# Altium schematic sheet Block Diagram.SchDoc
size A3; Revision: 00; SheetNumber: 2; SheetTotal: 5; Page Size: A3; Prepared By: Rumeysa Şahin; Changed Date: 15.11.2022
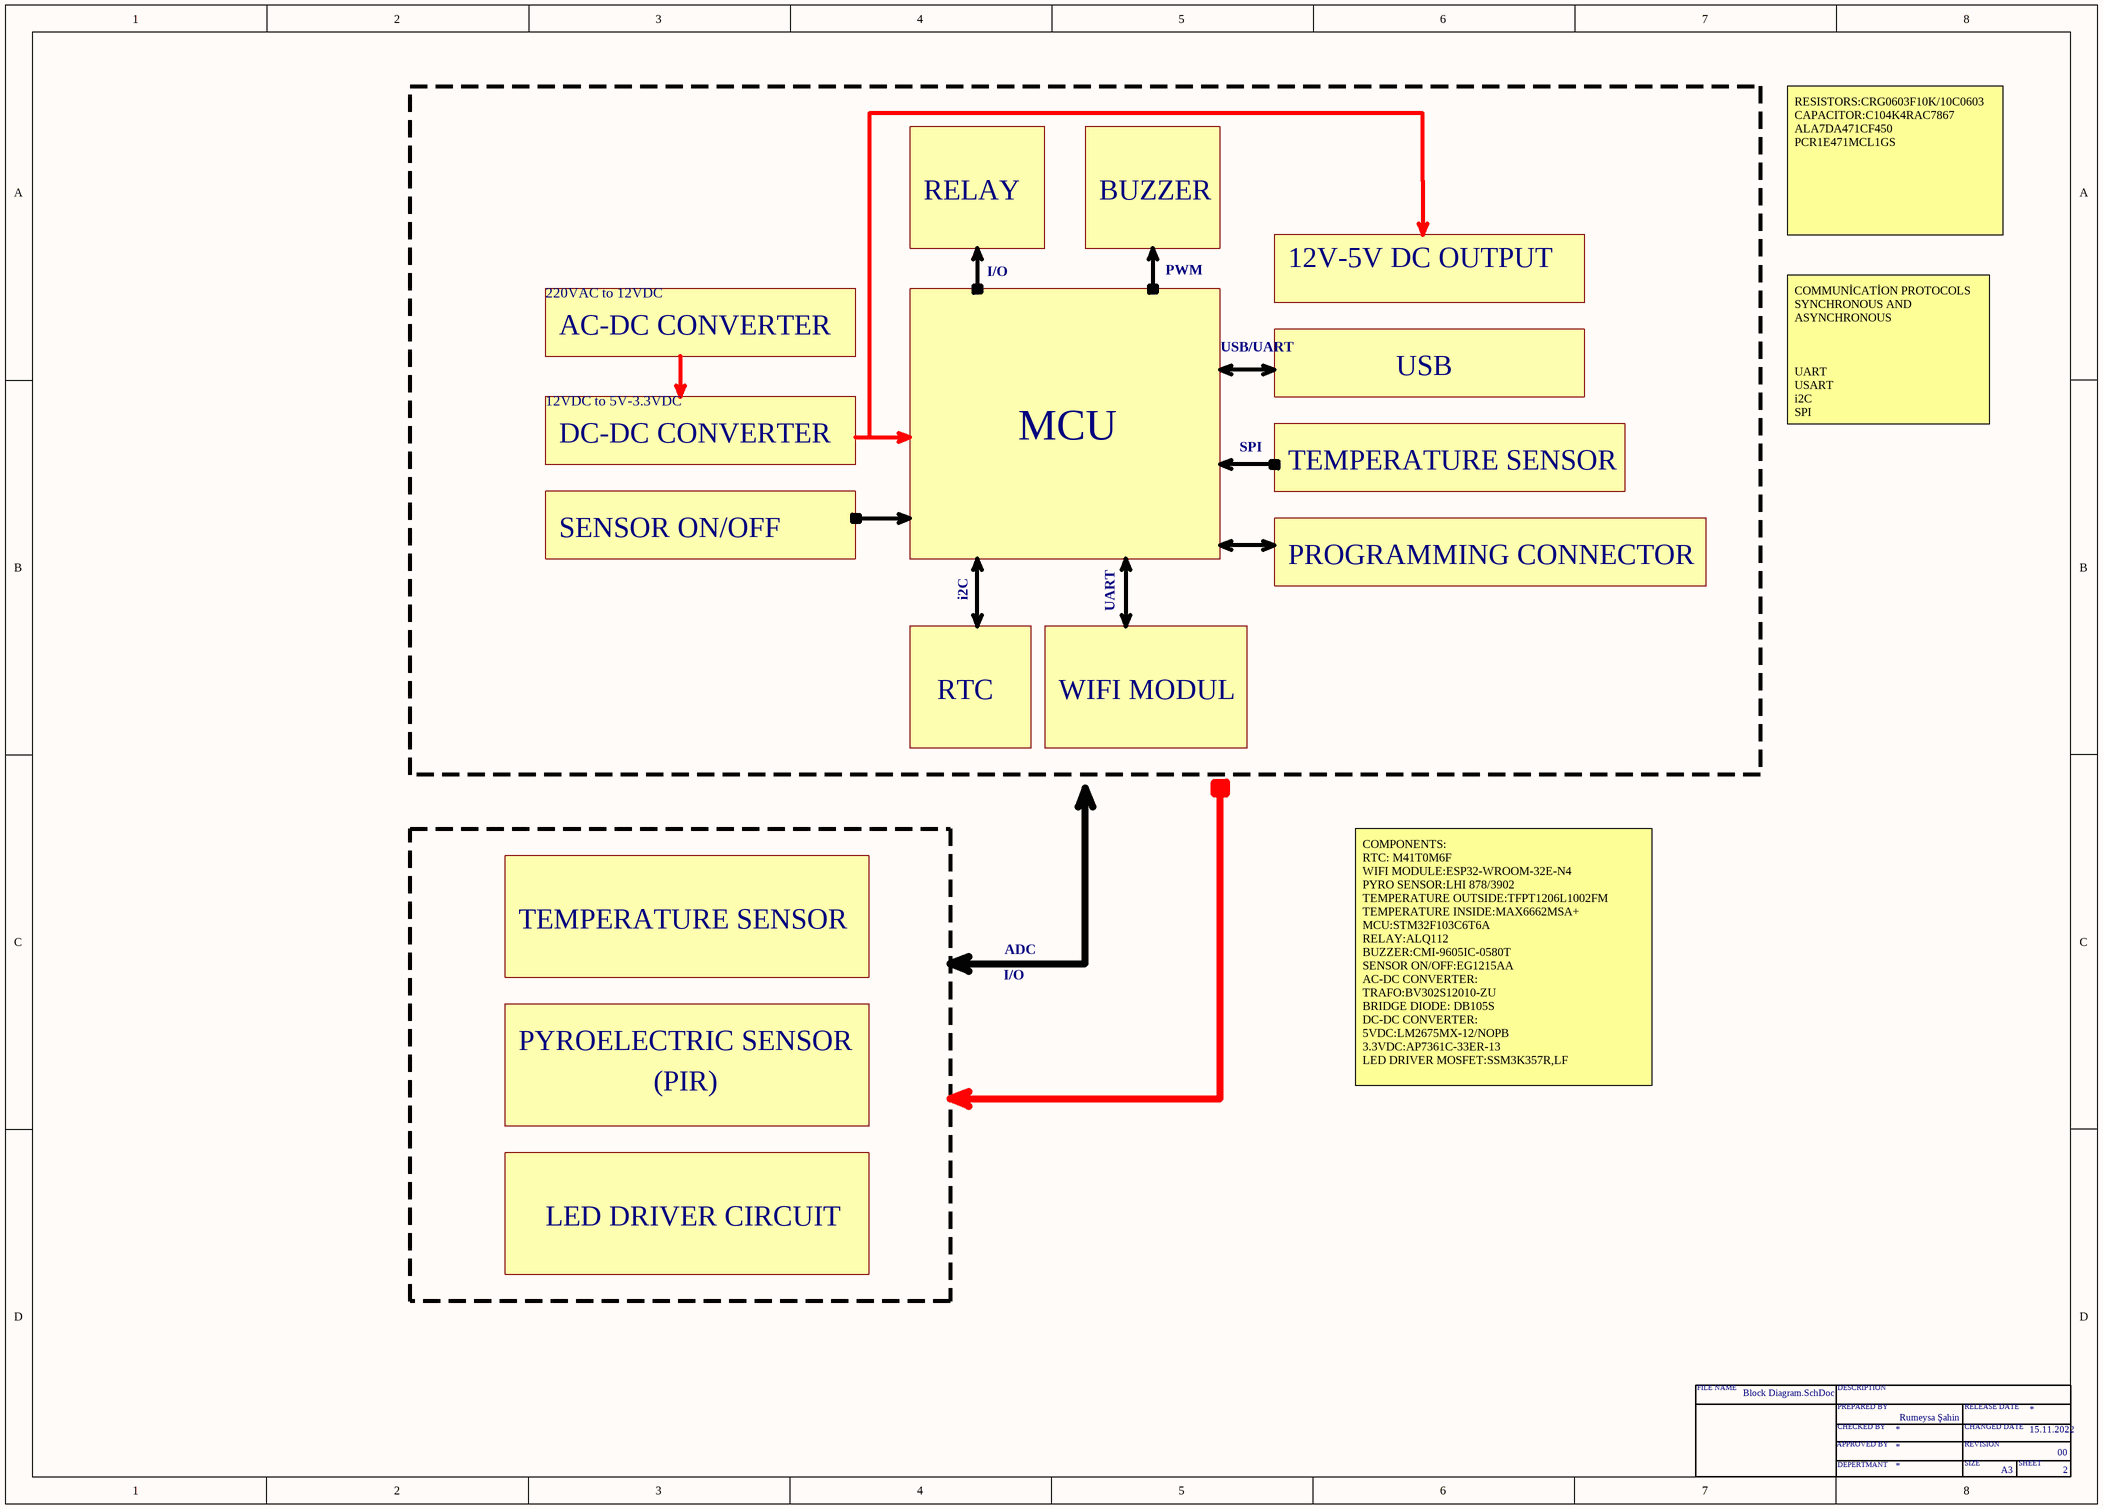
[diagram p0: Block Diagram.SchDoc]

## Notes on the sheet
- RELAY
- BUZZER
- RESISTORS:CRG0603F10K/10C0603                             CAPACITOR:C104K4RAC7867              ALA7DA471CF450            PCR1E471MCL1GS
- 220VAC to 12VDC
- I/O
- PWM
- 12V-5V DC OUTPUT
- AC-DC CONVERTER
- USB/UART
- USB
- 12VDC to 5V-3.3VDC
- DC-DC CONVERTER
- MCU
- SPI
- COMMUNİCATİON PROTOCOLS
  SYNCHRONOUS AND ASYNCHRONOUS
  UART
  USART
  i2C
  SPI
- TEMPERATURE SENSOR
- SENSOR ON/OFF
- PROGRAMMING CONNECTOR
- i2C
- UART
- RTC
- WIFI MODUL
- ADC
- PYROELECTRIC SENSOR
- (PIR)
- COMPONENTS:
  RTC: M41T0M6F
  WIFI MODULE:ESP32-WROOM-32E-N4
  PYRO SENSOR:LHI 878/3902
  TEMPERATURE OUTSIDE:TFPT1206L1002FM
  TEMPERATURE INSIDE:MAX6662MSA+
  MCU:STM32F103C6T6A
  RELAY:ALQ112
  BUZZER:CMI-9605IC-0580T
  SENSOR ON/OFF:EG1215AA
  AC-DC CONVERTER:                                   TRAFO:BV302S12010-ZU
  BRIDGE DIODE: DB105S
  DC-DC CONVERTER:
  5VDC:LM2675MX-12/NOPB
  3.3VDC:AP7361C-33ER-13
  LED DRIVER MOSFET:SSM3K357R,LF
- LED DRIVER CIRCUIT
- FILE NAME
- DESCRIPTION
- APPROVED BY
- PREPARED BY
- CHECKED BY
- RELEASE DATE
- CHANGED DATE
- REVISION
- SIZE
- SHEET
- DEPERTMANT
- A3